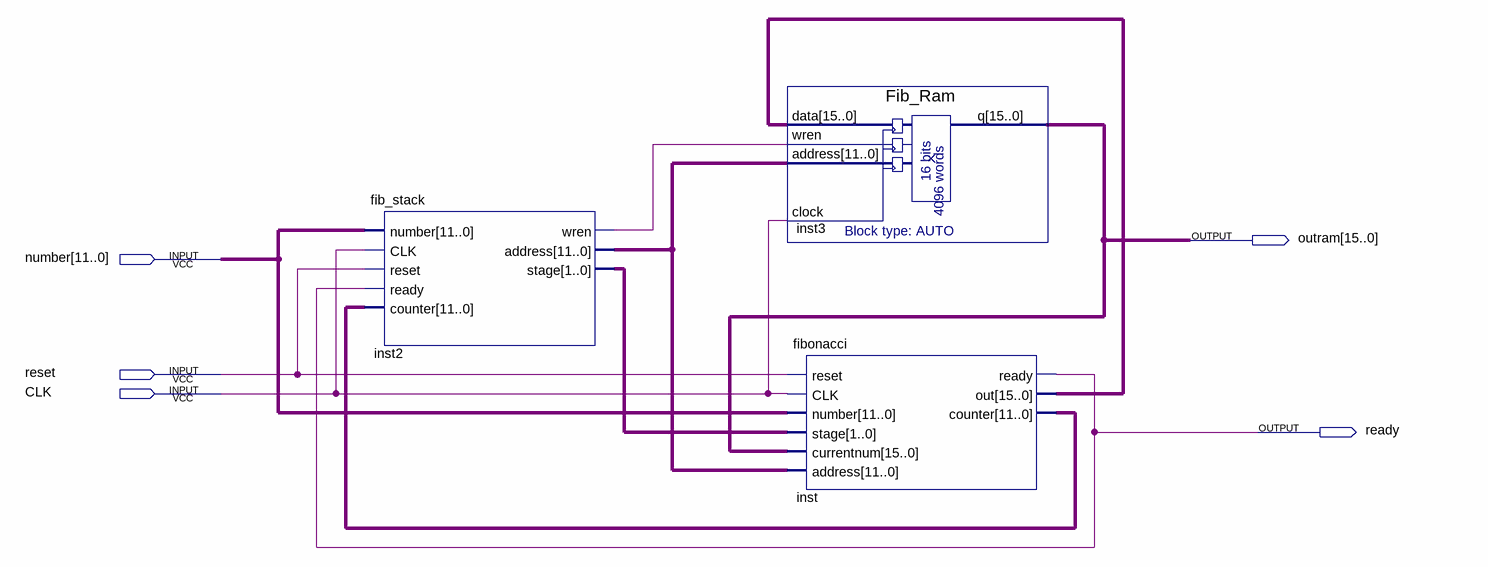
[diagram p0: schematic sheet]
// Quartus schematic fib.bdf as structural Verilog: 3 symbols, 5 pins
module fib (
  input  [11:0] number,
  input  reset,
  input  CLK,
  output [15:0] outram,
  output ready
);

  wire inst2_wren;
  wire [1:0] inst2_stage;
  wire [11:0] inst2_address, inst_counter;
  wire [15:0] inst_out;

  fib_stack inst2 (
    .number(number), .CLK(CLK), .reset(reset), .ready(ready), .counter(inst_counter), .wren(inst2_wren),
    .address(inst2_address), .stage(inst2_stage));
  Fib_Ram inst3 (.data(inst_out), .wren(inst2_wren), .address(inst2_address), .clock(CLK), .q(outram));
  fibonacci inst (
    .reset(reset), .CLK(CLK), .number(number), .stage(inst2_stage), .currentnum(outram),
    .address(inst2_address), .ready(ready), .out(inst_out), .counter(inst_counter));
endmodule
